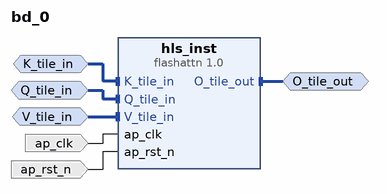
[diagram p0: block diagram of the top level]
# Vivado block design bd_0, xc7z020clg400-1, Vivado 2024.2
create_bd_design bd_0

create_bd_intf_port -mode Slave -vlnv xilinx.com:interface:axis_rtl:1.0 K_tile_in
set_property -dict [list \
  CONFIG.FREQ_HZ 100000000.0 \
  CONFIG.HAS_TKEEP 1 \
  CONFIG.HAS_TLAST 1 \
  CONFIG.HAS_TREADY 1 \
  CONFIG.HAS_TSTRB 1 \
  CONFIG.LAYERED_METADATA undef \
  CONFIG.TDATA_NUM_BYTES 4 \
  CONFIG.TDEST_WIDTH 0 \
  CONFIG.TID_WIDTH 0 \
  CONFIG.TUSER_WIDTH 0 \
] [get_bd_intf_ports K_tile_in]
create_bd_intf_port -mode Master -vlnv xilinx.com:interface:axis_rtl:1.0 O_tile_out
set_property -dict {CONFIG.FREQ_HZ 100000000.0} [get_bd_intf_ports O_tile_out]
create_bd_intf_port -mode Slave -vlnv xilinx.com:interface:axis_rtl:1.0 Q_tile_in
set_property -dict [list \
  CONFIG.FREQ_HZ 100000000.0 \
  CONFIG.HAS_TKEEP 1 \
  CONFIG.HAS_TLAST 1 \
  CONFIG.HAS_TREADY 1 \
  CONFIG.HAS_TSTRB 1 \
  CONFIG.LAYERED_METADATA undef \
  CONFIG.TDATA_NUM_BYTES 4 \
  CONFIG.TDEST_WIDTH 0 \
  CONFIG.TID_WIDTH 0 \
  CONFIG.TUSER_WIDTH 0 \
] [get_bd_intf_ports Q_tile_in]
create_bd_intf_port -mode Slave -vlnv xilinx.com:interface:axis_rtl:1.0 V_tile_in
set_property -dict [list \
  CONFIG.FREQ_HZ 100000000.0 \
  CONFIG.HAS_TKEEP 1 \
  CONFIG.HAS_TLAST 1 \
  CONFIG.HAS_TREADY 1 \
  CONFIG.HAS_TSTRB 1 \
  CONFIG.LAYERED_METADATA undef \
  CONFIG.TDATA_NUM_BYTES 4 \
  CONFIG.TDEST_WIDTH 0 \
  CONFIG.TID_WIDTH 0 \
  CONFIG.TUSER_WIDTH 0 \
] [get_bd_intf_ports V_tile_in]
create_bd_port -dir I -type clk ap_clk
set_property -dict {CONFIG.FREQ_HZ 100000000.0} [get_bd_ports ap_clk]
create_bd_port -dir I -type rst ap_rst_n

create_bd_cell -type ip -vlnv xilinx.com:hls:flashattn:1.0 hls_inst

# ---- connections ----

connect_bd_intf_net -intf_net K_tile_in_0_1 [get_bd_intf_ports K_tile_in] [get_bd_intf_pins hls_inst/K_tile_in]
connect_bd_intf_net -intf_net Q_tile_in_0_1 [get_bd_intf_ports Q_tile_in] [get_bd_intf_pins hls_inst/Q_tile_in]
connect_bd_intf_net -intf_net V_tile_in_0_1 [get_bd_intf_ports V_tile_in] [get_bd_intf_pins hls_inst/V_tile_in]
connect_bd_intf_net [get_bd_intf_ports O_tile_out] [get_bd_intf_pins hls_inst/O_tile_out]
connect_bd_net -net ap_clk_0_1 [get_bd_ports ap_clk] [get_bd_pins hls_inst/ap_clk]
connect_bd_net -net ap_rst_n_0_1 [get_bd_ports ap_rst_n] [get_bd_pins hls_inst/ap_rst_n]

validate_bd_design
save_bd_design
